# Altium schematic sheet TerminationDifferential.SchDoc
size A4; CompanyName: Technische Hochschule Nürnberg Georg Simon Ohm; Address1: Fürther Straße 250; Address2: 90429 Nürnberg; Address3: GERMANY; CompanyName2: Institut ELSYS
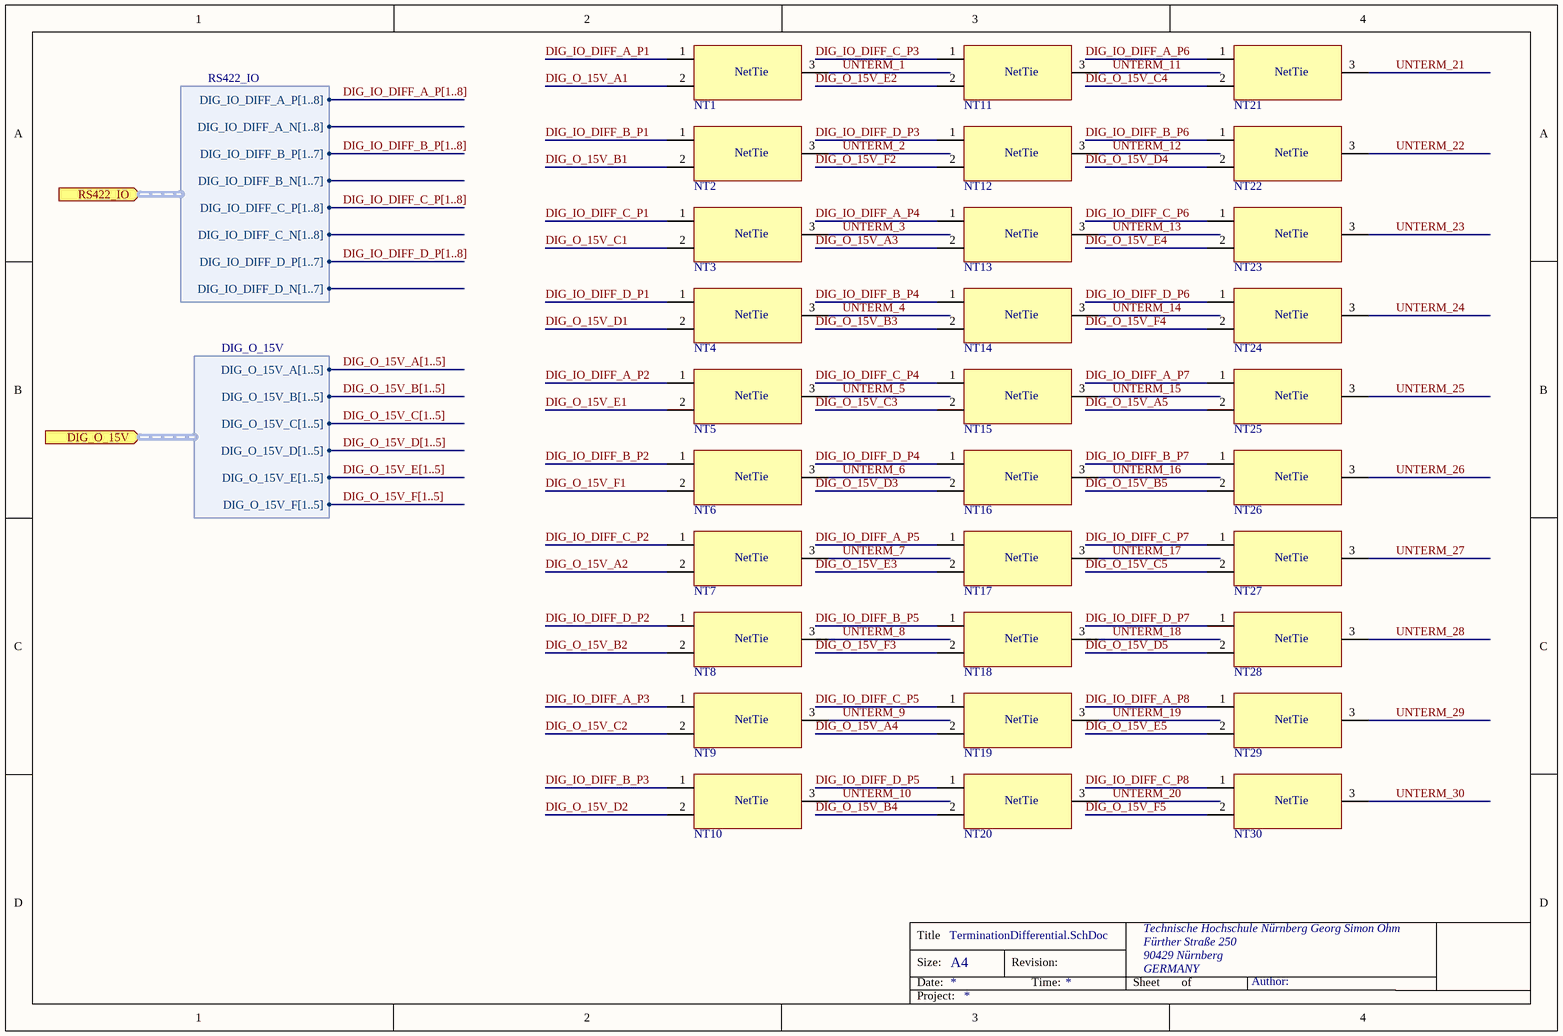
[diagram p0: TerminationDifferential.SchDoc]

## Parts
NT1  NetTie_2_to_1  [2_to_1_NetTie_0.3mm]  (value not drawn)  (net tie, no BOM)
NT2  NetTie_2_to_1  [2_to_1_NetTie_0.3mm]  (value not drawn)  (net tie, no BOM)
NT3  NetTie_2_to_1  [2_to_1_NetTie_0.3mm]  (value not drawn)  (net tie, no BOM)
NT4  NetTie_2_to_1  [2_to_1_NetTie_0.3mm]  (value not drawn)  (net tie, no BOM)
NT5  NetTie_2_to_1  [2_to_1_NetTie_0.3mm]  (value not drawn)  (net tie, no BOM)
NT6  NetTie_2_to_1  [2_to_1_NetTie_0.3mm]  (value not drawn)  (net tie, no BOM)
NT7  NetTie_2_to_1  [2_to_1_NetTie_0.3mm]  (value not drawn)  (net tie, no BOM)
NT8  NetTie_2_to_1  [2_to_1_NetTie_0.3mm]  (value not drawn)  (net tie, no BOM)
NT9  NetTie_2_to_1  [2_to_1_NetTie_0.3mm]  (value not drawn)  (net tie, no BOM)
NT10  NetTie_2_to_1  [2_to_1_NetTie_0.3mm]  (value not drawn)  (net tie, no BOM)
NT11  NetTie_2_to_1  [2_to_1_NetTie_0.3mm]  (value not drawn)  (net tie, no BOM)
NT12  NetTie_2_to_1  [2_to_1_NetTie_0.3mm]  (value not drawn)  (net tie, no BOM)
NT13  NetTie_2_to_1  [2_to_1_NetTie_0.3mm]  (value not drawn)  (net tie, no BOM)
NT14  NetTie_2_to_1  [2_to_1_NetTie_0.3mm]  (value not drawn)  (net tie, no BOM)
NT15  NetTie_2_to_1  [2_to_1_NetTie_0.3mm]  (value not drawn)  (net tie, no BOM)
NT16  NetTie_2_to_1  [2_to_1_NetTie_0.3mm]  (value not drawn)  (net tie, no BOM)
NT17  NetTie_2_to_1  [2_to_1_NetTie_0.3mm]  (value not drawn)  (net tie, no BOM)
NT18  NetTie_2_to_1  [2_to_1_NetTie_0.3mm]  (value not drawn)  (net tie, no BOM)
NT19  NetTie_2_to_1  [2_to_1_NetTie_0.3mm]  (value not drawn)  (net tie, no BOM)
NT20  NetTie_2_to_1  [2_to_1_NetTie_0.3mm]  (value not drawn)  (net tie, no BOM)
NT21  NetTie_2_to_1  [2_to_1_NetTie_0.3mm]  (value not drawn)  (net tie, no BOM)
NT22  NetTie_2_to_1  [2_to_1_NetTie_0.3mm]  (value not drawn)  (net tie, no BOM)
NT23  NetTie_2_to_1  [2_to_1_NetTie_0.3mm]  (value not drawn)  (net tie, no BOM)
NT24  NetTie_2_to_1  [2_to_1_NetTie_0.3mm]  (value not drawn)  (net tie, no BOM)
NT25  NetTie_2_to_1  [2_to_1_NetTie_0.3mm]  (value not drawn)  (net tie, no BOM)
NT26  NetTie_2_to_1  [2_to_1_NetTie_0.3mm]  (value not drawn)  (net tie, no BOM)
NT27  NetTie_2_to_1  [2_to_1_NetTie_0.3mm]  (value not drawn)  (net tie, no BOM)
NT28  NetTie_2_to_1  [2_to_1_NetTie_0.3mm]  (value not drawn)  (net tie, no BOM)
NT29  NetTie_2_to_1  [2_to_1_NetTie_0.3mm]  (value not drawn)  (net tie, no BOM)
NT30  NetTie_2_to_1  [2_to_1_NetTie_0.3mm]  (value not drawn)  (net tie, no BOM)

## Ports
DIG_O_15V (in, harness DIG_O_15V), RS422_IO (in, harness RS422_IO)

## Harnesses
RS422_IO: DIG_IO_DIFF_A_N[1..8], DIG_IO_DIFF_A_P[1..8], DIG_IO_DIFF_B_N[1..7], DIG_IO_DIFF_B_P[1..7], DIG_IO_DIFF_C_N[1..8], DIG_IO_DIFF_C_P[1..8], DIG_IO_DIFF_D_N[1..7], DIG_IO_DIFF_D_P[1..7]
DIG_O_15V: DIG_O_15V_A[1..5], DIG_O_15V_B[1..5], DIG_O_15V_C[1..5], DIG_O_15V_D[1..5], DIG_O_15V_E[1..5], DIG_O_15V_F[1..5]

## Nets

Not connected (* = marked no-connect by the designer): NT1 1 2 3; NT2 1 2 3; NT3 1 2 3; NT4 1 2 3; NT5 1 2 3; NT6 1 2 3; NT7 1 2 3; NT8 1 2 3; NT9 1 2 3; NT10 1 2 3; NT11 1 2 3; NT12 1 2 3; NT13 1 2 3; NT14 1 2 3; NT15 1 2 3; NT16 1 2 3; NT17 1 2 3; NT18 1 2 3; NT19 1 2 3; NT20 1 2 3; NT21 1 2 3; NT22 1 2 3; NT23 1 2 3; NT24 1 2 3; NT25 1 2 3; NT26 1 2 3; NT27 1 2 3; NT28 1 2 3; NT29 1 2 3; NT30 1 2 3

## Buses and harness runs
bus DIG_IO_DIFF_A_P[1..8]
bus DIG_IO_DIFF_B_P[1..8]
bus DIG_IO_DIFF_C_P[1..8]
bus DIG_IO_DIFF_D_P[1..8]
bus DIG_O_15V_A[1..5]
bus DIG_O_15V_B[1..5]
bus DIG_O_15V_C[1..5]
bus DIG_O_15V_D[1..5]
bus DIG_O_15V_E[1..5]
bus DIG_O_15V_F[1..5]

## Notes on the sheet
- Title
- Size:
- Date:
- A4
- Revision:
- Time:
- Sheet
- of
- Author:
- Project:
- (in symbol NetTie_2_to_1) NetTie

## Library data of the parts
NT1-NT30 = NetTie_2_to_1: Created: 2020-01-03_Thilo_Wendt